# EAGLE design joystick (EAGLE 6.4)
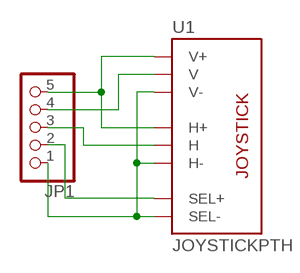
[diagram p0: schematic, sheet 1]

## Parts
JP1  PINHD-1X5  [1X05]
U1  JOYSTICKPTH  [JOYSTICK]

## Nets
N$1: JP1.5 U1.H1(H+) U1.V1(V+)
N$2: JP1.1 U1.B2A(SEL-) U1.H3(H-) U1.V3(V-)
N$3: JP1.4 U1.V2(V)
N$4: JP1.3 U1.H2(H)
N$5: JP1.2 U1.B1A(SEL+)

## Library data of the parts
JP1 = pinhead:PINHD-1X5: PIN HEADER
U1 = adafruit:JOYSTICK: Thumb Joystick Joystick commonly found in PS2 controllers. Two pots and a select switch. Adapted from Sparkfun Library (but for more common 6mm switch sticks)

## Board
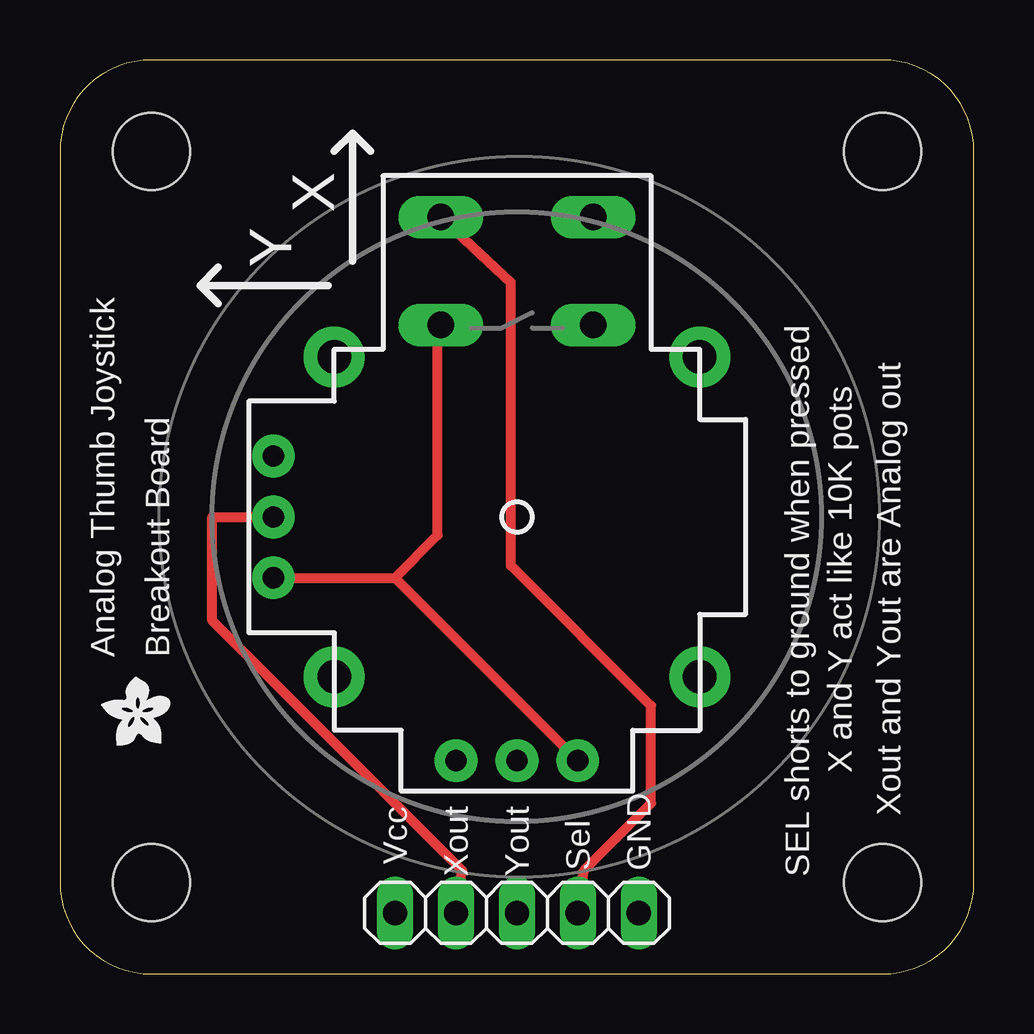
[diagram p1: board, top side]
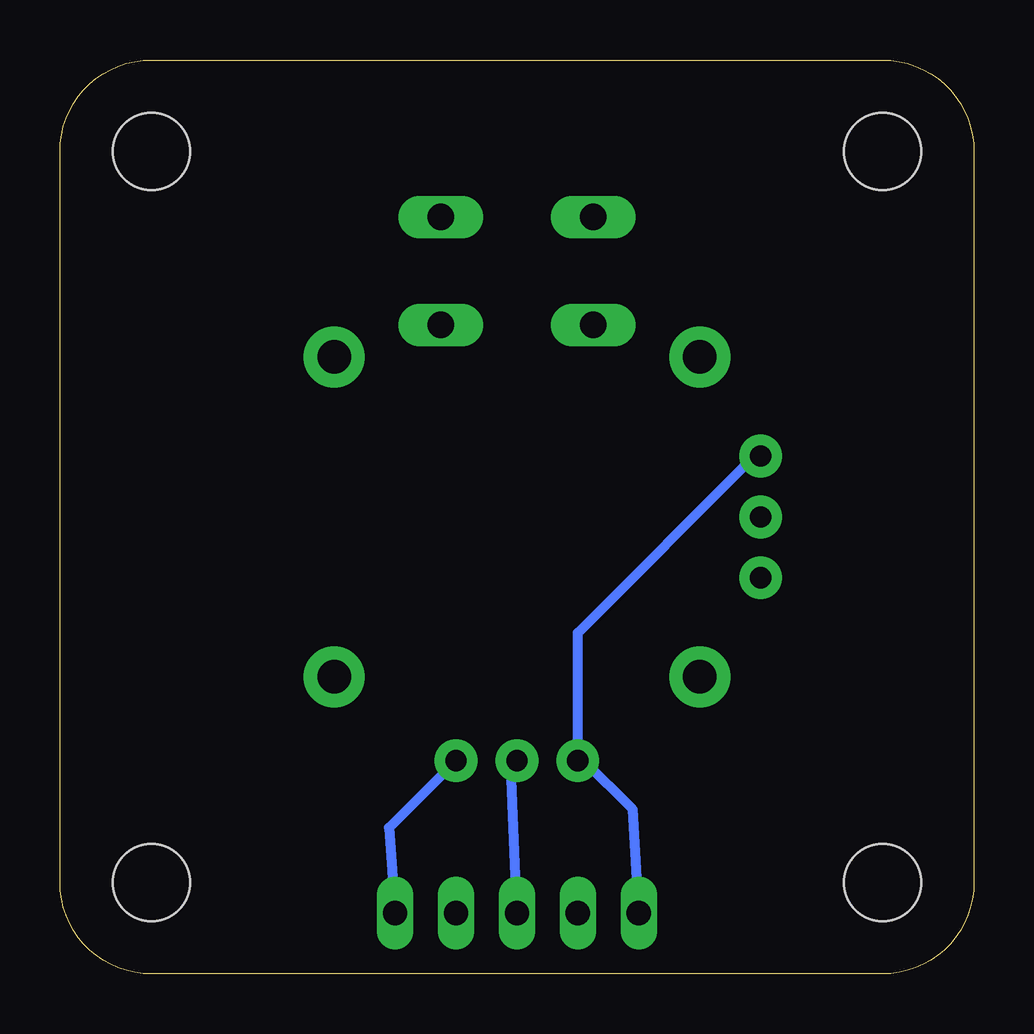
[diagram p2: board, bottom side, seen from below]

Size 38.1 x 38.1 mm. Coordinates in mm from the lower left corner, seen from the top.
Outline: 34.29,0 arc90 38.1,3.81 38.1,34.29 arc90 34.29,38.1 3.81,38.1 arc90 0,34.29 0,3.81 arc90 3.81,0 34.29,0
Copper layers (1*16): Top 0.035mm / dielectric 1.5mm / Bottom 0.035mm
Design rules "default": minimum track width 10mil, minimum drill 24mil, track to track 8mil, track to pad 8mil, pad to pad 8mil, via to via 8mil, smd to smd 8mil, copper to edge 40mil, drill to drill 8mil, minimum pad ring 10mil, minimum via ring 8mil, stop-mask expansion 4mil, vias tented up to drill 0mil, thermal gap 10mil
Holes 3.2 mm at 3.81,3.81 3.81,34.29 34.29,34.29 34.29,3.81

### Footprints (pad centres in the part's own frame; a part is rotated, then mirrored left to right if it is on the bottom)
1X05 = drill 1.016 long: 1 -5.08,0; 2 -2.54,0; 3 0,0; 4 2.54,0; 5 5.08,0
JOYSTICK = drill 1.1 pad 1.778 long: B1A -3.175,12.501; B1B 3.175,12.501; B2A -3.175,8.001; B2B 3.175,8.001 | drill 0.889 pad 1.778: H1 -2.54,-10.16; H2 0,-10.16; H3 2.54,-10.16; V1 -10.16,2.54; V2 -10.16,0; V3 -10.16,-2.54 | drill 1.397 pad 2.54: MOUNT1 -7.62,6.668; MOUNT2 -7.62,-6.668; MOUNT3 7.62,-6.668; MOUNT4 7.62,6.668

### Placement (x,y rotation side)
JP1  19.05,2.54 180 top
U1  19.05,19.05 0 top
U$1  [ADAFRUIT200MIL]  3.05,10.92 0 top

### Tracks (layer width: path | path; a pad name or v marks a point on that pad's centre or on a via)
N$1
  Bottom 0.406: JP1.5 14.22,6.86 16.26,8.89 U1.H1 16.51,14.22 9.14,21.59 U1.V1
N$2
  Top 0.406: U1.B2A 15.75,26.67 15.75,18.29 13.97,16.51 | U1.V3 13.97,16.51 | 13.97,16.51 U1.H3
  Bottom 0.406: JP1.1 24.38,6.1 U1.H3
N$3
  Top 0.406: JP1.4 16.76,4.32 6.35,14.73 6.35,19.05 U1.V2
N$4
  Bottom 0.406: JP1.3 19.3,8.64 U1.H2
N$5
  Top 0.406: U1.B1A 18.8,28.83 18.8,17.02 24.64,11.18 24.64,7.11 21.84,4.32 JP1.2

### Text on the board
tPlace: X | Y | Analog Thumb Joystick | Breakout Board | X and Y act like 10K pots | Xout and Yout are Analog out | Vcc | Xout | Yout | Sel | GND | SEL shorts to ground when pressed